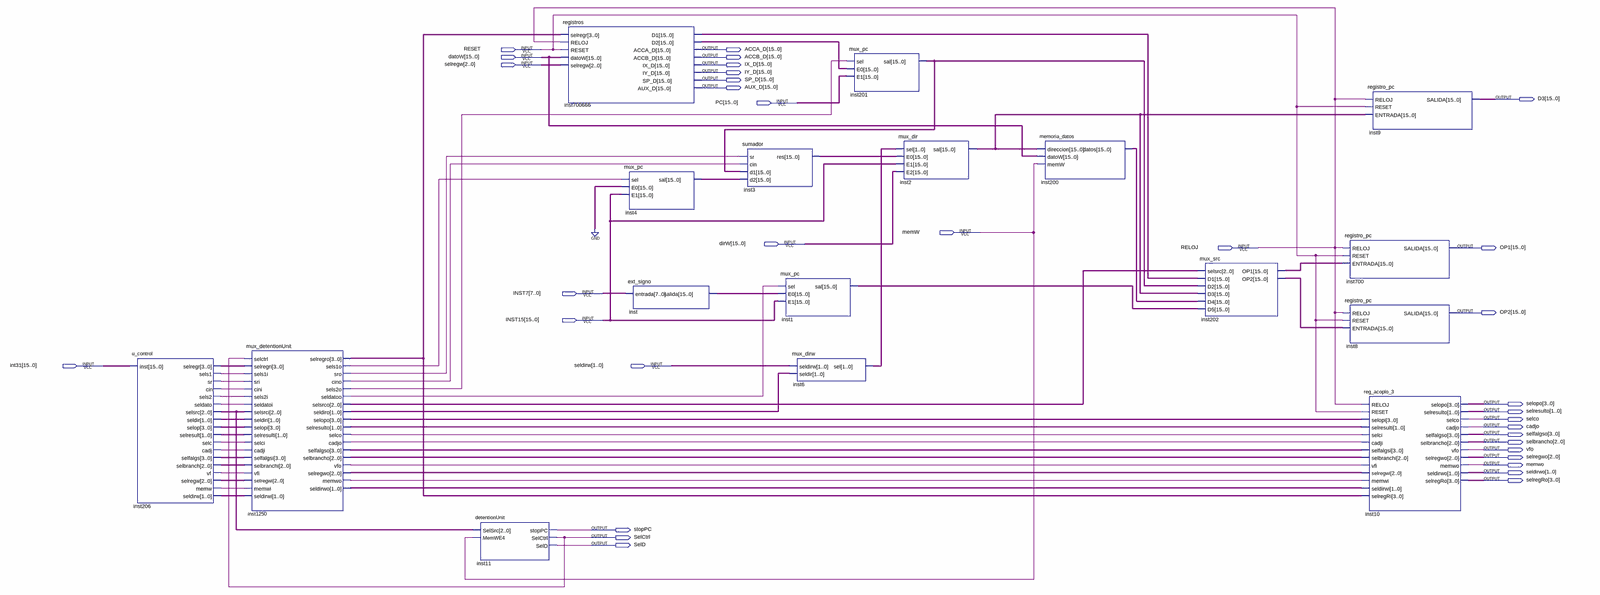
[diagram p0: schematic sheet, whole]
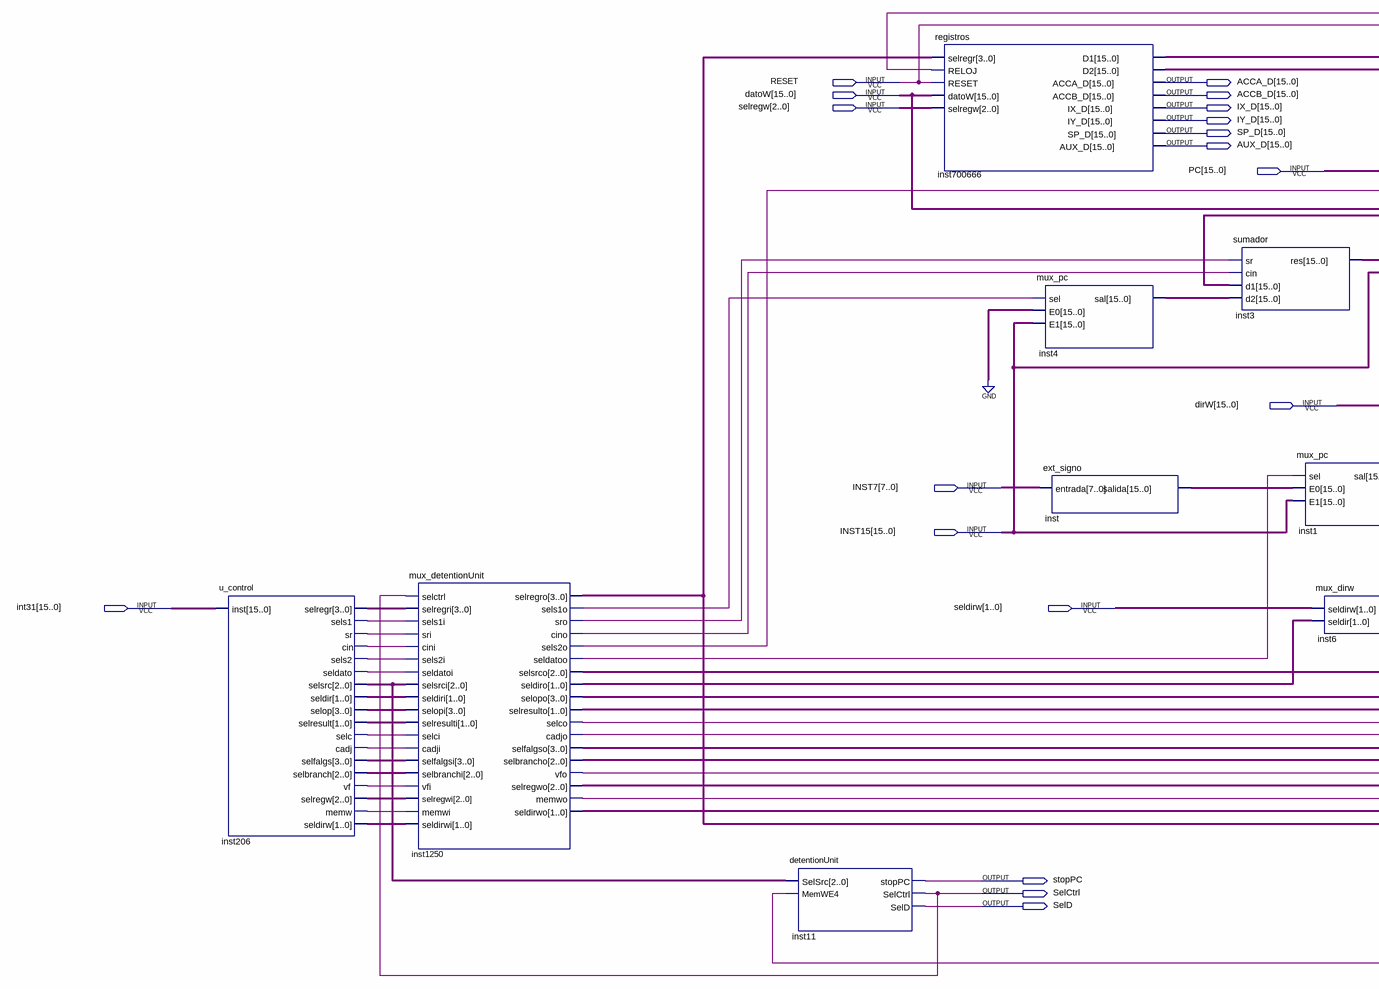
[diagram p1: schematic sheet, left part]
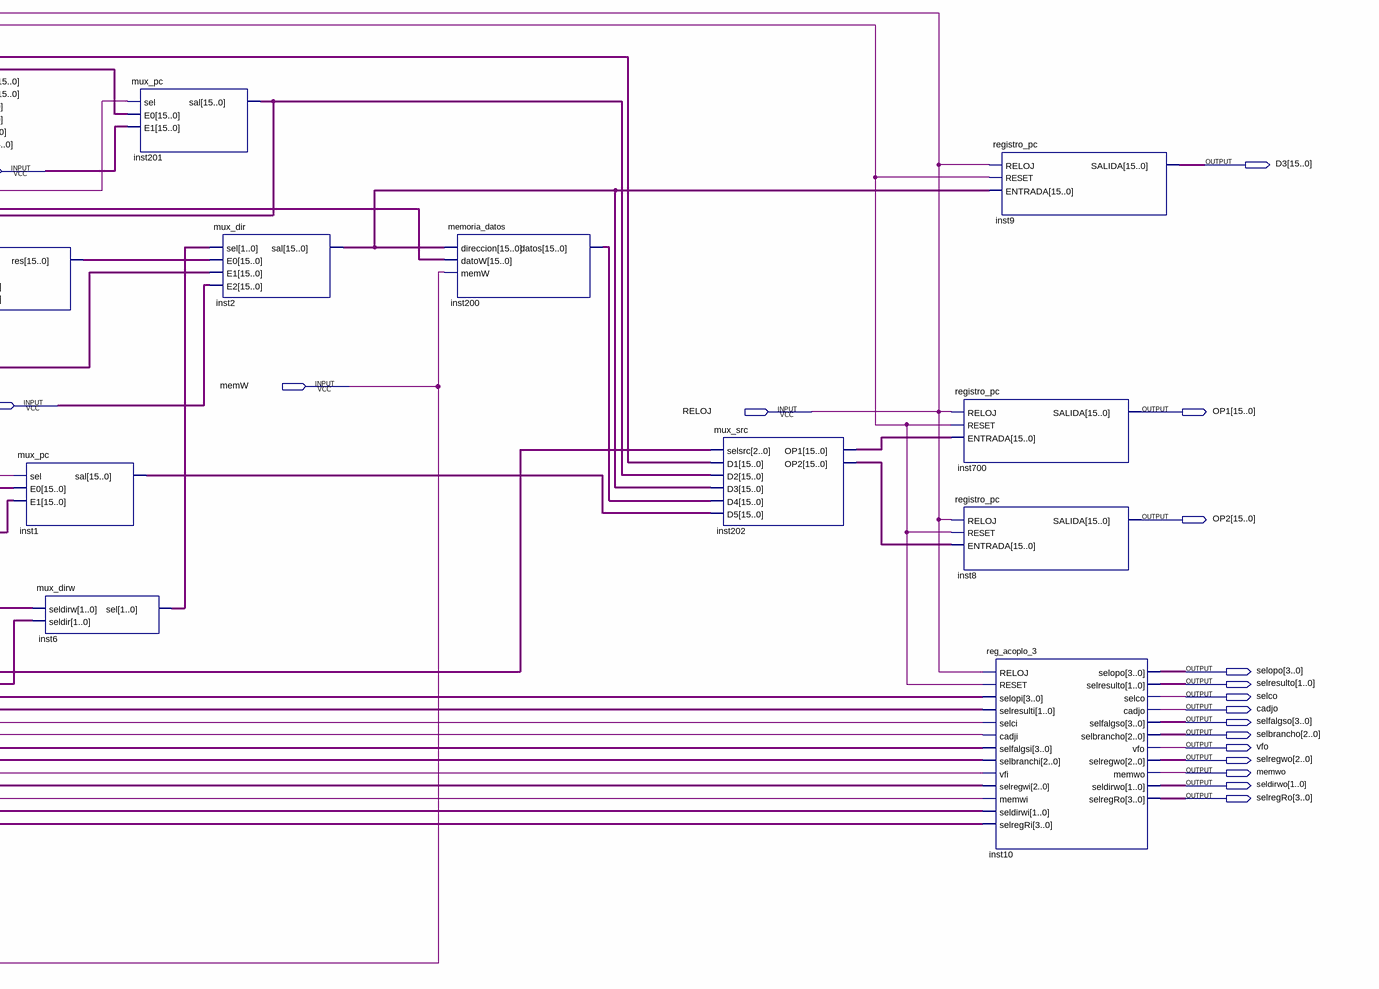
[diagram p2: schematic sheet, right part]
// Quartus schematic etapa2.bdf as structural Verilog: 17 symbols, 34 pins
module etapa2 (
  input  RESET,
  input  [15:0] datoW,
  input  [2:0] selregw,
  input  [15:0] PC,
  input  memW,
  input  [15:0] dirW,
  input  RELOJ,
  input  [7:0] INST7,
  input  [15:0] INST15,
  input  [15:0] int31,
  input  [1:0] seldirw,
  output [15:0] ACCA_D,
  output [15:0] ACCB_D,
  output [15:0] IX_D,
  output [15:0] IY_D,
  output [15:0] SP_D,
  output [15:0] AUX_D,
  output [15:0] D3,
  output [15:0] OP1,
  output [15:0] OP2,
  output [3:0] selopo,
  output [1:0] selresulto,
  output selco,
  output cadjo,
  output [3:0] selfalgso,
  output [2:0] selbrancho,
  output vfo,
  output [2:0] selregwo,
  output memwo,
  output [1:0] seldirwo,
  output [3:0] selregRo,
  output stopPC,
  output SelCtrl,
  output SelD
);

  wire inst206_cadj, inst206_cin, inst206_memw, inst206_selc, inst206_seldato, inst206_sels1, inst206_sels2,
       inst206_sr, inst206_vf, inst1250_cadjo, inst1250_cino, inst1250_memwo, inst1250_selco,
       inst1250_seldatoo, inst1250_sels1o, inst1250_sels2o, inst1250_sro, inst1250_vfo;
  wire [1:0] inst6_sel, inst206_seldir, inst206_seldirw, inst206_selresult, inst1250_seldiro,
       inst1250_seldirwo, inst1250_selresulto;
  wire [2:0] inst206_selbranch, inst206_selregw, inst206_selsrc, inst1250_selbrancho, inst1250_selregwo,
       inst1250_selsrco;
  wire [3:0] inst206_selfalgs, inst206_selop, inst206_selregr, inst1250_selfalgso, inst1250_selopo,
       inst1250_selregro;
  wire [15:0] inst1_sal, inst2_sal, inst3_res, inst4_sal, inst200_datos, inst201_sal, inst202_op1,
       inst202_op2, inst700666_d1, inst700666_d2, inst_salida;

  u_control inst206 (
    .inst(int31), .selregr(inst206_selregr), .sels1(inst206_sels1), .sr(inst206_sr), .cin(inst206_cin),
    .sels2(inst206_sels2), .seldato(inst206_seldato), .selsrc(inst206_selsrc), .seldir(inst206_seldir),
    .selop(inst206_selop), .selresult(inst206_selresult), .selc(inst206_selc), .cadj(inst206_cadj),
    .selfalgs(inst206_selfalgs), .selbranch(inst206_selbranch), .vf(inst206_vf), .selregw(inst206_selregw),
    .memw(inst206_memw), .seldirw(inst206_seldirw));
  mux_detentionUnit inst1250 (
    .selctrl(SelCtrl), .selregri(inst206_selregr), .sels1i(inst206_sels1), .sri(inst206_sr),
    .cini(inst206_cin), .sels2i(inst206_sels2), .seldatoi(inst206_seldato), .selsrci(inst206_selsrc),
    .seldiri(inst206_seldir), .selopi(inst206_selop), .selresulti(inst206_selresult), .selci(inst206_selc),
    .cadji(inst206_cadj), .selfalgsi(inst206_selfalgs), .selbranchi(inst206_selbranch), .vfi(inst206_vf),
    .selregwi(inst206_selregw), .memwi(inst206_memw), .seldirwi(inst206_seldirw),
    .selregro(inst1250_selregro), .sels1o(inst1250_sels1o), .sro(inst1250_sro), .cino(inst1250_cino),
    .sels2o(inst1250_sels2o), .seldatoo(inst1250_seldatoo), .selsrco(inst1250_selsrco),
    .seldiro(inst1250_seldiro), .selopo(inst1250_selopo), .selresulto(inst1250_selresulto),
    .selco(inst1250_selco), .cadjo(inst1250_cadjo), .selfalgso(inst1250_selfalgso),
    .selbrancho(inst1250_selbrancho), .vfo(inst1250_vfo), .selregwo(inst1250_selregwo),
    .memwo(inst1250_memwo), .seldirwo(inst1250_seldirwo));
  detentionUnit inst11 (.SelSrc(inst206_selsrc), .MemWE4(memW), .stopPC(stopPC), .SelCtrl(SelCtrl), .SelD(SelD));
  registros inst700666 (
    .selregr(inst1250_selregro), .RELOJ(RELOJ), .RESET(RESET), .datoW(datoW), .selregw(selregw),
    .D1(inst700666_d1), .D2(inst700666_d2), .ACCA_D(ACCA_D), .ACCB_D(ACCB_D), .IX_D(IX_D), .IY_D(IY_D),
    .SP_D(SP_D), .AUX_D(AUX_D));
  mux_pc inst4 (.sel(inst1250_sels1o), .E0({16{1'b0}}), .E1(INST15), .sal(inst4_sal));
  ext_signo inst (.entrada(INST7), .salida(inst_salida));
  sumador inst3 (.sr(inst1250_sro), .cin(inst1250_cino), .d1(inst201_sal), .d2(inst4_sal), .res(inst3_res));
  mux_pc inst1 (.sel(inst1250_seldatoo), .E0(inst_salida), .E1(INST15), .sal(inst1_sal));
  mux_dirw inst6 (.seldirw(seldirw), .seldir(inst1250_seldiro), .sel(inst6_sel));
  mux_pc inst201 (.sel(inst1250_sels2o), .E0(inst700666_d2), .E1(PC), .sal(inst201_sal));
  mux_dir inst2 (.sel(inst6_sel), .E0(inst3_res), .E1(INST15), .E2(dirW), .sal(inst2_sal));
  memoria_datos inst200 (.direccion(inst2_sal), .datoW(datoW), .memW(memW), .datos(inst200_datos));
  mux_src inst202 (
    .selsrc(inst1250_selsrco), .D1(inst700666_d1), .D2(inst201_sal), .D3(inst2_sal), .D4(inst200_datos),
    .D5(inst1_sal), .OP1(inst202_op1), .OP2(inst202_op2));
  registro_pc inst700 (.RELOJ(RELOJ), .RESET(RESET), .ENTRADA(inst202_op1), .SALIDA(OP1));
  registro_pc inst8 (.RELOJ(RELOJ), .RESET(RESET), .ENTRADA(inst202_op2), .SALIDA(OP2));
  registro_pc inst9 (.RELOJ(RELOJ), .RESET(RESET), .ENTRADA(inst2_sal), .SALIDA(D3));
  reg_acoplo_3 inst10 (
    .RELOJ(RELOJ), .RESET(RESET), .selopi(inst1250_selopo), .selresulti(inst1250_selresulto),
    .selci(inst1250_selco), .cadji(inst1250_cadjo), .selfalgsi(inst1250_selfalgso),
    .selbranchi(inst1250_selbrancho), .vfi(inst1250_vfo), .selregwi(inst1250_selregwo),
    .memwi(inst1250_memwo), .seldirwi(inst1250_seldirwo), .selregRi(inst1250_selregro), .selopo(selopo),
    .selresulto(selresulto), .selco(selco), .cadjo(cadjo), .selfalgso(selfalgso), .selbrancho(selbrancho),
    .vfo(vfo), .selregwo(selregwo), .memwo(memwo), .seldirwo(seldirwo), .selregRo(selregRo));
endmodule
